# Altium schematic sheet IsoPowerSupply.SchDoc
size A4
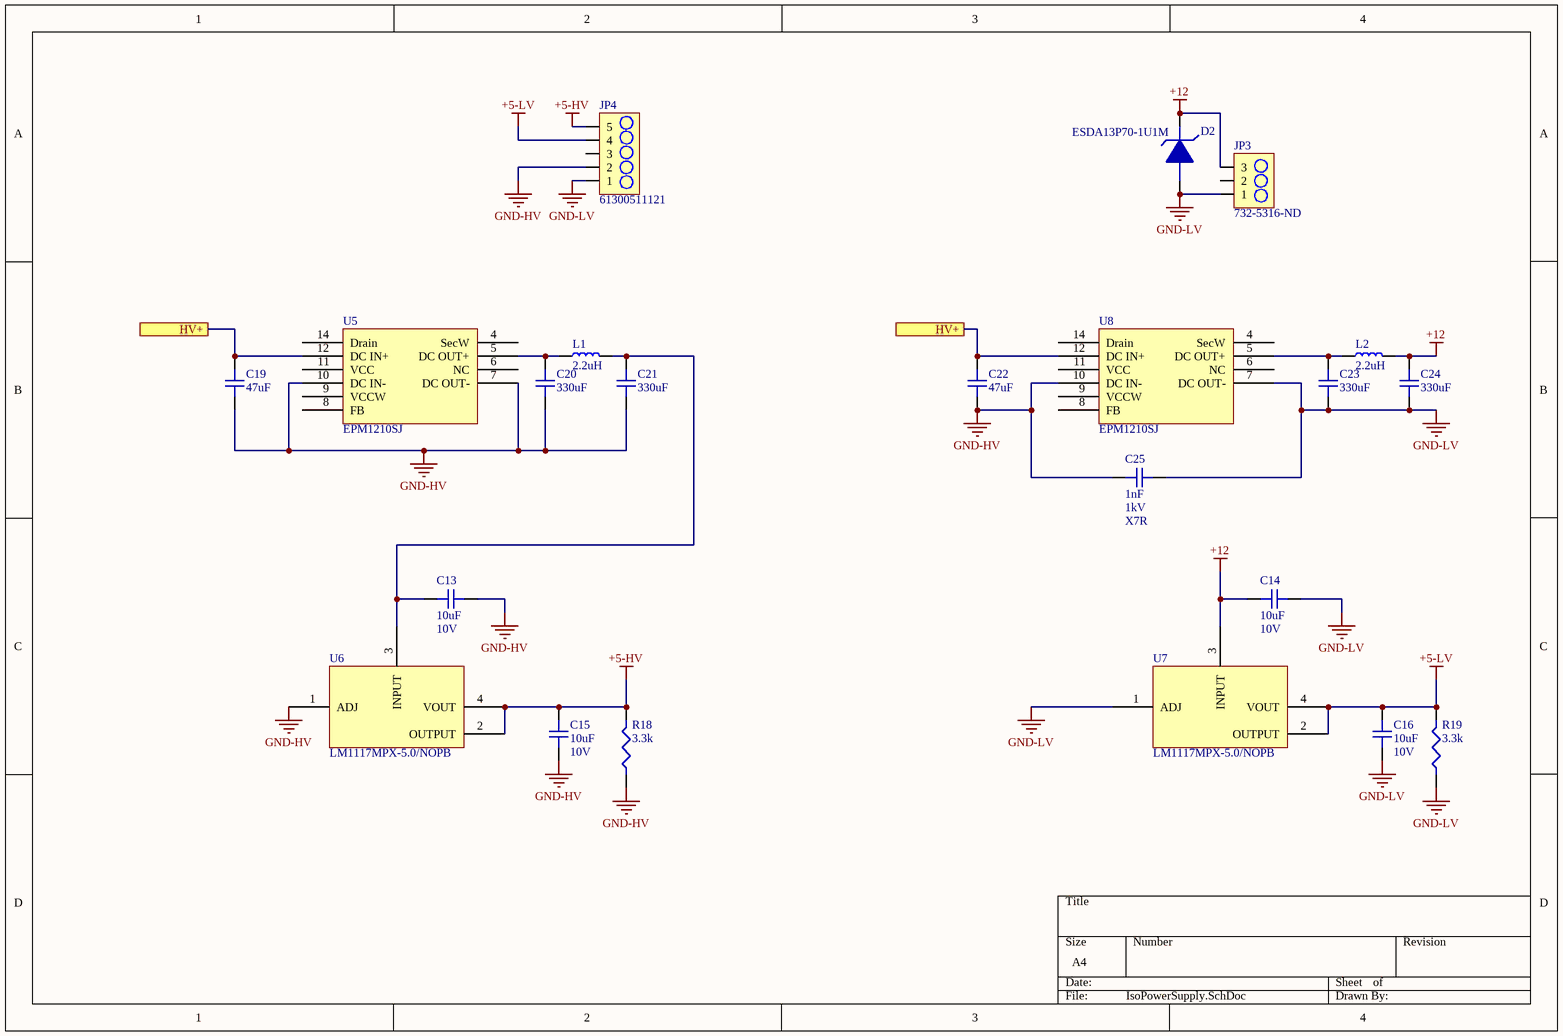
[diagram p0: IsoPowerSupply.SchDoc]

## Parts
C13  10uF  Voltage Rating: 10V  [TANT_10u]
C14  10uF  Voltage Rating: 10V  [TANT_10u]
C15  10uF  Voltage Rating: 10V  [TANT_10u]
C16  10uF  Voltage Rating: 10V  [TANT_10u]
C19  47uF  [radial cap, 5mm spacing]
C20  330uF  [radial cap, 5mm spacing]
C21  330uF  [radial cap, 5mm spacing]
C22  47uF  [radial cap, 5mm spacing]
C23  330uF  [radial cap, 5mm spacing]
C24  330uF  [radial cap, 5mm spacing]
C25  1nF  Voltage Rating: 1kV  Dielectric: X7R  [C1206]
D2  ESDA13P70-1U1M  [DIODE_TVS_0603]
JP3  732-5316-ND  [3PIN_HEADER]
JP4  61300511121  [5PIN_HEADER]
L1  2.2uH  [L0805]
L2  2.2uH  [L0805]
R18  3.3k  [R0805]
R19  3.3k  [R0805]
U5  EPM1210SJ  [14-DIP Module]
U6  LM1117MPX-5.0/NOPB  [LM1117MPX-5.0/NOPB]
U7  LM1117MPX-5.0/NOPB  [LM1117MPX-5.0/NOPB]
U8  EPM1210SJ  [14-DIP Module]

## Ports
HV+

## Nets
+5-HV: C15.2 JP4.5 R18.2 U6.2(OUTPUT) U6.4(VOUT)
+5-LV: C16.2 JP4.4 R19.2 U7.2(OUTPUT) U7.4(VOUT)
+12: C14.1 C24.2 D2.1 JP3.3 L2.2 U7.3(INPUT)
GND-HV: C13.2 C15.1 C19.1 C20.1 C21.1 C22.1 C25.1 JP4.2 R18.1 U5.7(DC_OUT-) U5.10(DC_IN-) U6.1(ADJ) U8.10(DC_IN-)
GND-LV: C14.2 C16.1 C23.1 C24.1 C25.2 D2.2 JP3.1 JP4.1 R19.1 U7.1(ADJ) U8.7(DC_OUT-)
HV+: C19.2 C22.2 U5.12(DC_IN+) U8.12(DC_IN+) ; port HV+
NetC13_1: C13.1 C21.2 L1.2 U6.3(INPUT)
NetC20_2: C20.2 L1.1 U5.5(DC_OUT+)
NetC23_2: C23.2 L2.1 U8.5(DC_OUT+)

Not connected (* = marked no-connect by the designer): JP3 2; JP4 3; U5 4(SecW) 6(NC) 8(FB) 9(VCCW) 11(VCC) 14(Drain); U8 4(SecW) 6(NC) 8(FB) 9(VCCW) 11(VCC) 14(Drain)

## Library data of the parts
C13-C16 = F381A106MMA: CAP TANTALUM 10uF, 0603 [1608 Metric], 0.5 ohm, 10 V AVX  Surface Mount Tantalum Capacitor, F38 Series, 10uF, 0603 [1608 Metric], 0.5 ohm, 10 V; Manufacturer: Kyocera AVX; Tolerance: 20%; ESR (Equivalent Series Resistance): 500mR; Life (Hours): 1000Hour; Dissipation Factor: 15%; Leakage Current: 10uA; Supplier 1: Digi-Key; Manufacturer Part Number: F381A106MMA; Stock 1: 7989; Pricing 1: 1=0.75, 10=0.551, 100=0.3779, 500=0.2992, 1000=0.2519 (USD); Case/Package: 0603; Weight: 7.1E-05oz; Case Code (Metric): 1608; Case Code (Imperial): 0603; Min Operating Temperature: -55°C; Max Operating Temperature: 105°C; Capacitance: 10uF; Packaging: Tape and Reel; Termination: SMD/SMT; Package Quantity: 4000; Voltage Rating (DC): 10V; Length: 1.6mm; Height: 0.8mm; Width: 0.033inch; Height - Seated (Max): 0.035inch; Depth: 0.85mm; Radiation Hardening: No; REACH SVHC: No SVHC; ComponentLink1URL: https://datasheet.ciiva.com/48510/f38-48510901.pdf; ComponentLink1Description: https://datasheet.ciiva.com/48510/f38-48510901.pdf; ComponentLink2URL: https://datasheet.ciiva.com/46417/1805432-46417517.pdf; ComponentLink2Description: https://datasheet.ciiva.com/46417/1805432-46417517.pdf; ComponentLink3URL: https://datasheet.ciiva.com/46417/1805432-46417518.pdf; ComponentLink3Description: https://datasheet.ciiva.com/46417/1805432-46417518.pdf; Supplier Part Number 1: 478-9527-1-ND
C19 C22 = UKL2A470KPD: CAP  47µF 100V Aluminum Electrolytic Capacitors Radial, Can 2000 Hrs @ 85°C; Manufacturer: Nichicon; Tolerance: 10%; Manufacturer Part Number: UKL2A470KPD; Mount: Through Hole; Case/Package: Radial, can; Min Operating Temperature: -40°C; Max Operating Temperature: 85°C; Capacitance: 47uF; Packaging: Bulk; Package Quantity: 1; Radiation Hardening: No; Voltage Rating: 100V; ComponentLink1Description: http://nichicon-us.com/english/products/pdfs/e-ukl.pdf; ComponentLink1URL: http://nichicon-us.com/english/products/pdfs/e-ukl.pdf; Supplier 1: Digi-Key; Supplier Part Number 1: 493-14500-ND
C20 C21 C23 C24 = UKL1H331KHD: CAP 330µF 50V Aluminum Electrolytic Capacitors Radial, Can 2000 Hrs @ 85°C; Manufacturer: Nichicon; Tolerance: 10%; Manufacturer Part Number: UKL1H331KHD; Mount: Through Hole; Case/Package: Radial, can; Min Operating Temperature: -40°C; Max Operating Temperature: 85°C; Capacitance: 330uF; Packaging: Bulk; Package Quantity: 1; Radiation Hardening: No; Voltage Rating: 50V; Supplier 1: Digi-Key; Supplier Part Number 1: 493-15384-ND; ComponentLink1Description: http://nichicon-us.com/english/products/pdfs/e-ukl.pdf; ComponentLink1URL: http://nichicon-us.com/english/products/pdfs/e-ukl.pdf
C25 = CC1206KKX7RCBB102: CAP MLCC 1000PF 1KV X7R 1206 Series Comm. Isolation Caps; Manufacturer: Yageo; Dielectric Material: Ceramic; Tolerance: 10%; Supplier 1: Digi-Key; Manufacturer Part Number: CC1206KKX7RCBB102; Stock 1: 28118; Pricing 1: 1=0.15, 10=0.106, 100=0.0501, 500=0.0351, 1000=0.0291 (USD); Mount: Surface Mount; Case/Package: 1206; Number of Pins: 2; Weight: 0.000571oz; Case Code (Imperial): 1206; Case Code (Metric): 3216; Min Operating Temperature: -55°C; Max Operating Temperature: 125°C; Capacitance: 1nF; Packaging: Tape and Reel; Package Quantity: 1; Voltage Rating (DC): 1kV; Termination: SMD/SMT; Composition: Ceramic; Length: 3.2mm; Height: 1.15mm; Width: 1.6mm; Thickness: 0.045inch; Depth: 1.6mm; Radiation Hardening: No; REACH SVHC: No SVHC; Lead Free: Lead Free; ComponentLink1URL: https://datasheet.ciiva.com/147/upy-np0x7r-hv-1kv-to-3kv-4-147253.pdf; ComponentLink1Description: https://datasheet.ciiva.com/147/upy-np0x7r-hv-1kv-to-3kv-4-147253.pdf; ComponentLink2URL: https://datasheet.ciiva.com/17435/hv-17435317.pdf; ComponentLink2Description: https://datasheet.ciiva.com/17435/hv-17435317.pdf; ComponentLink3URL: https://datasheet.ciiva.com/11466/hv-11466696.pdf; ComponentLink3Description: https://datasheet.ciiva.com/11466/hv-11466696.pdf; ComponentLink4URL: https://datasheet.ciiva.com/26863/getdatasheetpartid-651408-26863102.pdf; ComponentLink4Description: https://datasheet.ciiva.com/26863/getdatasheetpartid-651408-26863102.pdf; Supplier Part Number 1: 311-1144-1-ND
D2 = ESDA13P70-1U1M: TVS diode 12V, 20V Clamp 60A (8/20µs) Ipp Tvs Diode Surface Mount 1610; Manufacturer: STMicroelectronics; Type: Zener; Power peak pulse: 1300W; Voltage breakdown: 12.5V; Manufacturer Part Number: ESDA13P70-1U1M; Mount: Surface Mount; Current peak Pulse: 60A; Packaging: Tape and Reel; Voltage - Reverse standoff: 12V; Voltage Clamping: 20V; Lead Free: Lead Free; Supplier 1: Digi-Key; ComponentLink1Description: http://www.st.com/content/ccc/resource/technical/document/datasheet/70/53/14/01/33/8d/48/ca/DM00218249.pdf/files/DM00218249.pdf/jcr:content/translations/en.DM00218249.pdf; ComponentLink1URL: http://www.st.com/content/ccc/resource/technical/document/datasheet/70/53/14/01/33/8d/48/ca/DM00218249.pdf/files/DM00218249.pdf/jcr:content/translations/en.DM00218249.pdf; Supplier Part Number 1: 497-16271-1-ND
JP3 = 61300311121: CONN_HeaderPins3pos WURTH ELEKTRONIK Board-To-Board Connector, Vertical, WR-PHD Series, Through Hole, Header, 3 Contacts, 2.54 mm; Manufacturer: Wurth Electronics; Number of Positions: 3; Gender: Male; Connector Type: Male Pin; Pitch: 0.1inch; Supplier 1: Digi-Key; Manufacturer Part Number: 61300311121; Stock 1: 57026; Pricing 1: 1=0.13, 10=0.106, 25=0.088, 50=0.074, 100=0.067, 1000=0.061 (USD); Mount: Through Hole; Case/Package: 100; Contact Plating: Gold; Contact Material: Copper; Colour: Black; Number of Rows: 1; Packaging: Bulk; Termination: Solder; Number of Contacts: 3; Contact Mating Length: 0.236inch; REACH SVHC: Unknown; Lead Free: Lead Free; ComponentLink1URL: http://www.farnell.com/cad/1737268.pdf; ComponentLink1Description: http://www.farnell.com/cad/1737268.pdf; Supplier Part Number 1: 732-5316-ND
JP4 = 61300511121: CONN_HeaderPins5pos WURTH ELEKTRONIK         61300511121            Board-To-Board Connector, Vertical, WR-PHD Series, Through Hole, Header, 5 Contacts, 2.54 mm; Manufacturer: Wurth Electronics; Number of Positions: 5; Gender: Male; Connector Type: Male Pin; Pitch: 0.1inch; Supplier 1: Digi-Key; Manufacturer Part Number: 61300511121; Stock 1: 13004; Pricing 1: 1=0.25, 10=0.209, 25=0.174, 50=0.145, 100=0.132, 1000=0.12 (USD); Mount: Through Hole; Contact Plating: Gold; Contact Material: Copper; Colour: Black; Number of Rows: 1; Packaging: Bulk; Termination: Solder; Number of Contacts: 5; Contact Mating Length: 0.236inch; REACH SVHC: Unknown; Lead Free: Lead Free; ComponentLink1URL: http://www.farnell.com/cad/1737268.pdf; ComponentLink1Description: http://www.farnell.com/cad/1737268.pdf; Supplier Part Number 1: 732-5318-ND
L1 L2 = DFE201210U-2R2M=P2: IND 2.2µH Shielded Wirewound Inductor 1.2A 228mOhm Max 0805 (2012 Metric); Manufacturer: Murata; Tolerance: 20%; Current Rating: 1.2V; Manufacturer Part Number: DFE201210U-2R2M=P2; Mount: Surface Mount; Case/Package: 0805; Case Code (Metric): 2012; Min Operating Temperature: -55°C; Max Operating Temperature: 125°C; Inductance: 2.2uH; Packaging: Tape and Reel; Package Quantity: 3000; Length: 2mm; Height: 1.25mm; Width: 0.063 inch; Thickness: 0.071 inch; Radiation Hardening: No; Supplier 1: Digi-Key; Supplier Part Number 1: 490-16592-2-ND
R18 R19 = ERA-6AEB332V: RES SMD 3.3k OHM 0805 3.3k Ohm 0.1% 0.125W(1/8W) ±25ppm/C Molded SMD Automotive Punched T/R; Manufacturer: Panasonic ECG; Manufacturer Part Number: ERA-6AEB102V; Voltage Rating: 100V; Resistance: 3.3kR; Power Rating: 125mW; Temperature Coefficient: 25ppm/°C; Mount: Surface Mount; Case/Package: 0805; Number of Pins: 2; Case Code (Metric): 2012; Case Code (Imperial): 0805; Contact Plating: Tin; Min Operating Temperature: -55°C; Max Operating Temperature: 155°C; Packaging: Tape and Reel; Tolerance: 0.1%; Package Quantity: 5000; Composition: Thin Film; Number of Terminations: 2; Military Standard: Not; Termination: SMD/SMT; Max Power Dissipation: 125mW; Length: 2mm; Height: 0.5mm; Width: 1.25mm; Depth: 1.25mm; Radiation Hardening: No; REACH SVHC: No SVHC; ComponentLink1Description: https://industrial.panasonic.com/cdbs/www-data/pdf/RDM0000/AOA0000C307.pdf; ComponentLink1URL: https://industrial.panasonic.com/cdbs/www-data/pdf/RDM0000/AOA0000C307.pdf; Supplier 1: Digi-Key; Supplier Part Number 1: P3.3KDATR-ND
U5 U8 = EPM1210SJ: Isolated Module DC DC Converter 1 Output 12V 1A 110V - 450V Input; Manufacturer: Tamura; Power: 12W; Voltage Isolation: 3kV; Efficiency: 80%; Manufacturer Part Number: EPM1210SJ; Case/Package: 14-DIP; Type: Isolated Module; Features: OTP, OCP, OVP; Current - Output: 1A; Voltage - Output: 12V; Voltage - Input: 110V - 450V; Operating Temperature: -20C - 80C; Mounting: Through Hole; Supplier 1: Digi-Key; Supplier Part Number 1: MT7382-ND; ComponentLink1Description: https://www.tamura-ss.co.jp/en/electronics/pdf/EPM1210SJ_1212AE.pdf; ComponentLink1URL: https://www.tamura-ss.co.jp/en/electronics/pdf/EPM1210SJ_1212AE.pdf
U6 U7 = LM1117MPX-5.0/NOPB: IC REG LINEAR 5V 800MA SOT223-4; Manufacturer: Texas Instruments; Manufacturer Part Number: NKE0503SC; Number of Outputs: 1; Max Input Voltage: 15V; Voltage Dropout Max: 1.2V @800mA; Current Supply: 10mA; Mount: Surface Mount; Case/Package: SOT-223-4; Number of Pins: 4; Min Operating Temperature: 0°C; Max Operating Temperature: 125°C; Packaging: Tape Real; Package Quantity: 2000; Output Current: 800mA; Output Voltage: 5V; ComponentLink1Description: http://www.ti.com/general/docs/suppproductinfo.tsp?distId=10&gotoUrl=http%3A%2F%2Fwww.ti.com%2Flit%2Fgpn%2Flm1117; ComponentLink1URL: http://www.ti.com/general/docs/suppproductinfo.tsp?distId=10&gotoUrl=http%3A%2F%2Fwww.ti.com%2Flit%2Fgpn%2Flm1117; Supplier 1: Digi-Key; Supplier Part Number 1: LM1117MPX-5.0/NOPBTR-ND